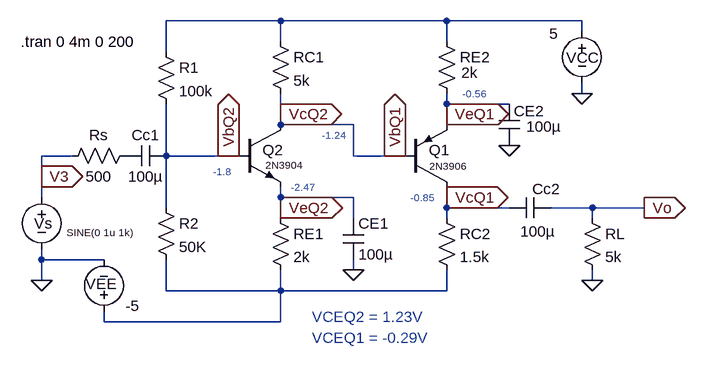
[diagram p0: schematic exam6_15_01.asc]
exam6_15_01.asc, the LTspice schematic file:
Version 4
SHEET 1 936 680
WIRE 176 -48 0 -48
WIRE 432 -48 176 -48
WIRE 640 -48 432 -48
WIRE 640 -32 640 -48
WIRE 176 -16 176 -48
WIRE 432 -16 432 -48
WIRE 0 0 0 -48
WIRE 640 64 640 48
WIRE 432 80 432 64
WIRE 528 80 432 80
WIRE 176 96 176 64
WIRE 432 96 432 80
WIRE 176 112 176 96
WIRE 288 112 176 112
WIRE 432 112 432 96
WIRE -144 160 -192 160
WIRE 0 160 0 80
WIRE 96 160 0 160
WIRE 112 160 96 160
WIRE 288 160 288 112
WIRE 352 160 288 160
WIRE 368 160 352 160
WIRE -192 192 -192 160
WIRE -192 224 -192 192
WIRE 176 224 176 208
WIRE 288 224 176 224
WIRE 432 224 432 208
WIRE 0 240 0 160
WIRE 176 240 176 224
WIRE 432 240 432 224
WIRE 528 240 432 240
WIRE 656 240 592 240
WIRE 736 240 656 240
WIRE 176 256 176 240
WIRE 288 256 288 224
WIRE 432 256 432 240
WIRE 656 256 656 240
WIRE -192 320 -192 304
WIRE -96 320 -192 320
WIRE 288 336 288 320
WIRE -192 352 -192 320
WIRE 656 352 656 336
WIRE 0 368 0 320
WIRE 176 368 176 336
WIRE 176 368 0 368
WIRE 432 368 432 336
WIRE 432 368 176 368
WIRE -96 416 -96 400
WIRE 176 416 176 368
WIRE 176 416 -96 416
FLAG 640 64 0
FLAG 736 240 Vo
IOPIN 736 240 Out
FLAG 176 96 VcQ2
IOPIN 176 96 Out
FLAG 96 160 VbQ2
IOPIN 96 160 Out
FLAG 352 160 VbQ1
IOPIN 352 160 Out
FLAG 432 96 VeQ1
IOPIN 432 96 Out
FLAG 432 224 VcQ1
IOPIN 432 224 Out
FLAG 176 240 VeQ2
IOPIN 176 240 Out
FLAG -192 192 V3
IOPIN -192 192 Out
FLAG -192 352 0
FLAG 288 336 0
FLAG 656 352 0
FLAG 528 144 0
SYMBOL npn 112 112 R0
WINDOW 0 36 39 Left 2
WINDOW 3 41 62 Left 1
SYMATTR InstName Q2
SYMATTR Value 2N3904
SYMBOL res -16 -16 R0
SYMATTR InstName R1
SYMATTR Value 100k
SYMBOL res -16 224 R0
SYMATTR InstName R2
SYMATTR Value 50K
SYMBOL res 160 -32 R0
SYMATTR InstName RC1
SYMATTR Value 5k
SYMBOL res 160 240 R0
SYMATTR InstName RE1
SYMATTR Value 2k
SYMBOL res 416 -32 R0
WINDOW 3 38 64 Left 2
SYMATTR InstName RE2
SYMATTR Value 2k
SYMBOL res 640 240 R0
SYMATTR InstName RL
SYMATTR Value 5k
SYMBOL voltage 640 -48 R0
WINDOW 0 -24 57 Left 2
WINDOW 3 -50 20 Left 2
WINDOW 123 0 0 Left 0
WINDOW 39 0 0 Left 0
SYMATTR InstName VCC
SYMATTR Value 5
SYMBOL voltage -192 208 R0
WINDOW 0 -11 56 Left 2
WINDOW 3 39 70 Left 1
WINDOW 123 43 89 Left 1
WINDOW 39 0 0 Left 0
SYMATTR InstName Vs
SYMATTR Value SINE(0 1u 1k)
SYMBOL cap 592 224 R90
WINDOW 0 3 7 VBottom 2
WINDOW 3 37 20 VTop 2
SYMATTR InstName Cc2
SYMATTR Value 100µ
SYMBOL cap 0 144 R90
WINDOW 0 0 32 VBottom 2
WINDOW 3 32 32 VTop 2
SYMATTR InstName Cc1
SYMATTR Value 100µ
SYMBOL res -48 144 R90
WINDOW 0 0 56 VBottom 2
WINDOW 3 32 56 VTop 2
SYMATTR InstName Rs
SYMATTR Value 500
SYMBOL cap 272 256 R0
SYMATTR InstName CE1
SYMATTR Value 100µ
SYMBOL pnp 368 208 M180
WINDOW 0 36 57 Left 2
WINDOW 3 37 32 Left 1
SYMATTR InstName Q1
SYMATTR Value 2N3906
SYMBOL res 416 240 R0
SYMATTR InstName RC2
SYMATTR Value 1.5k
SYMBOL cap 544 144 R180
WINDOW 0 -38 53 Left 2
WINDOW 3 -64 29 Left 2
SYMATTR InstName CE2
SYMATTR Value 100µ
SYMBOL voltage -96 416 R180
WINDOW 0 -19 59 Left 2
WINDOW 3 -55 25 Left 2
WINDOW 123 0 0 Left 0
WINDOW 39 0 0 Left 0
SYMATTR InstName VEE
SYMATTR Value -5
TEXT -224 -16 Left 2 !.tran 0 4m 0 200
TEXT 240 128 Left 1 ;-1.24
TEXT 72 184 Left 1 ;-1.8
TEXT 192 208 Left 1 ;-2.47
TEXT 456 64 Left 1 ;-0.56
TEXT 376 224 Left 1 ;-0.85
TEXT 224 408 Left 2 ;VCEQ2 = 1.23V
TEXT 224 440 Left 2 ;VCEQ1 = -0.29V

The netlist it stands for:
* exam6_15_01.asc
Q2 VbQ1 VbQ2 VeQ2 0 2N3904
R1 N001 VbQ2 100k
R2 VbQ2 N002 50K
RC1 N001 VbQ1 5k
RE1 VeQ2 N002 2k
RE2 N001 VeQ1 2k
RL Vo 0 5k
VCC N001 0 5
Vs V3 0 SINE(0 1u 1k)
Cc2 Vo VcQ1 100µ
Cc1 VbQ2 P001 100µ
Rs P001 V3 500
CE1 VeQ2 0 100µ
Q1 VcQ1 VbQ1 VeQ1 0 2N3906
RC2 VcQ1 N002 1.5k
CE2 0 VeQ1 100µ
VEE N002 0 -5
.model NPN NPN
.model PNP PNP
.lib standard.bjt
.tran 0 4m 0 200
* -1.24
* -1.8
* -2.47
* -0.56
* -0.85
* VCEQ2 = 1.23V
* VCEQ1 = -0.29V
.backanno
.end